# Altium schematic sheet Power.SchDoc
size 127 x 101 mm
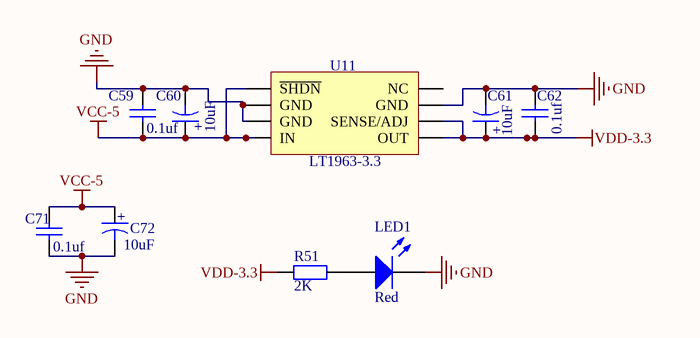
[diagram p0: Power.SchDoc]

## Parts
C59  value 0.1uf  [0805]  (hidden comment: Capacitor-0805)
C60  value 10uF  [钽电容1206（A3216）]  (hidden comment: 电解电容)
C61  value 10uF  [钽电容1206（A3216）]  (hidden comment: 电解电容)
C62  value 0.1uf  [0805]  (hidden comment: Capacitor-0805)
C71  value 0.1uf  [0805]  (hidden comment: Capacitor-0805)
C72  value 10uF  [钽电容1206（A3216）]  (hidden comment: 电解电容)
LED1  Color: Red  [LED-0805]  (hidden comment: LED)
R51  value 2K  [0603]  (hidden comment: Resistor-0603)
U11  LT1963  [LT1963]  (value not drawn)

## Nets
GND: C59.2 C60.1 C61.1 C62.2 C71.1 C72.1 LED1.2 U11.3(GND) U11.6(GND) U11.7(GND)
VCC-5: C59.1 C60.2 C71.2 C72.2 U11.5(~{SHDN}) U11.8(IN)
VDD-3.3: C61.2 C62.1 R51.2 U11.1(OUT) U11.2(SENSE/ADJ)
NetLED1_1: LED1.1(A) R51.1

Not connected (* = marked no-connect by the designer): U11 4(NC)

## Notes on the sheet
- (in symbol L) LT1963-3.3
- (in symbol 电解电容) +

## Library data of the parts
C59 C62 C71 = Capacitor
U11 = L
LED1 = LED: Value: LED